# EAGLE design controladorCarga (EAGLE 7.2.0)
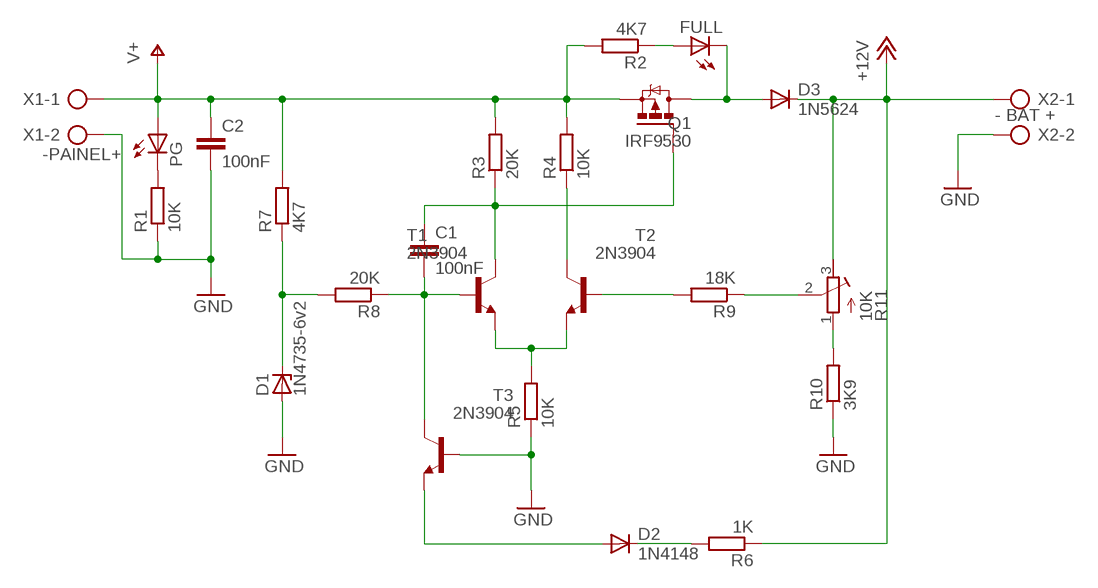
[diagram p0: schematic, sheet 1]

## Parts
C1  100nF  C-EU050-025X075  [C050-025X075]
C2  100nF  C-EU050-025X075  [C050-025X075]
D1  1N4735-6v2  1N4728  [DO41Z10]
D2  1N4148  1N4148DO35-7  [DO35-7]
D3  1N5624  [DO201-15]
FULL  LED5MM  [LED5MM]
PG  LED5MM  [LED5MM]
Q1  IRF9530  [TO220BV]
R1  10K  R-EU_0207/10  [0207/10]
R2  4K7  R-EU_0207/10  [0207/10]
R3  20K  R-EU_0207/10  [0207/10]
R4  10K  R-EU_0207/10  [0207/10]
R5  10K  R-EU_0207/10  [0207/10]
R6  1K  R-EU_0207/10  [0207/10]
R7  4K7  R-EU_0207/10  [0207/10]
R8  20K  R-EU_0204/7  [0204/7]
R9  18K  R-EU_0207/10  [0207/10]
R10  3K9  R-EU_0204/7  [0204/7]
R11  10K  R-TRIMM3339P  [RTRIM3339P]
T1  2N3904  [TO92]
T2  2N3904  [TO92]
T3  2N3904  [TO92]
X1  -PAINEL+  AK500/2  [AK500/2]
X2  - BAT +  AK500/2  [AK500/2]

## Nets
+12V: D3.C R6.1 R11.3(E) X2.1
GND: C2.2 D1.A R1.1 R5.1 R10.1 T3.2(B) X1.2 X2.2
N$1: PG.K(C) R1.2
N$2: FULL.A R2.1
N$3: C1.1 Q1.G R3.1 T1.1(C)
N$4: R4.1 T2.1(C)
N$5: D2.C R6.2
N$7: R5.2 T1.3(E) T2.3(E)
N$8: D3.A FULL.K(C) Q1.D
N$9: D1.C R7.1 R8.2
N$10: C1.2 R8.1 T1.2(B) T3.1(C)
N$12: D2.A T3.3(E)
N$13: R9.2 T2.2(B)
N$14: R9.1 R11.2(S)
N$15: R10.2 R11.1(A)
V+: C2.1 PG.A Q1.S R2.2 R3.2 R4.2 R7.2 X1.1

## Library data of the parts
C1 C2 = rcl:C-EU: CAPACITOR, European symbol
D1 = diode:1N4728: Z DIODE 3.3 V, 1W, 5 percent
D2 = diode:1N4148: DIODE high speed (Philips)
D3 = diode:1N5624: DIODE controlled avalanche rectifier
FULL PG = led:LED: LED OSRAM: - CHIPLED LG R971, LG N971, LY N971, LG Q971, LY Q971, LO R971, LY R971 LH N974, LH R974 LS Q976, LO Q976, LY Q976 LO Q996 - Hyper CHIPLED LW Q18S LB Q993, LB Q99A, LB R99A - SideLED LS A670, LO A670, LY A670, LG A670, LP A670 LB A673, LV A673, LT A673, LW A673 LH A674 LY A675 LS A676, LA A676, LO A676, LY A676, LW A676 LS A679, LY A679, LG A679 - Hyper Micro SIDELED® LS Y876, LA Y876, LO Y876, LY Y876 LT Y87S - SmartLED LW L88C, LW L88S LB L89C, LB L89S, LG L890 LS L89K, LO L89K, LY L89K LS L896, LA L896, LO L896, LY L896 - TOPLED LS T670, LO T670, LY T670, LG T670, LP T670 LSG T670, LSP T670, LSY T670, LOP T670, LYG T670 LG T671, LOG T671, LSG T671 LB T673, LV T673, LT T673, LW T673 LH T674 LS T676, LA T676, LO T676, LY T676, LB T676, LH T676, LSB T676, LW T676 LB T67C, LV T67C, LT T67C, LS T67K, LO T67K, LY T67K, LW E67C LS E67B, LA E67B, LO E67B, LY E67B, LB E67C, LV E67C, LT E67C LW T67C LS T679, LY T679, LG T679 LS T770, LO T770, LY T770, LG T770, LP T770 LB T773, LV T773, LT T773, LW T773 LH T774 LS E675, LA E675, LY E675, LS T675 LS T776, LA T776, LO T776, LY T776, LB T776 LHGB T686 LT T68C, LB T68C - Hyper Mini TOPLED® LB M676 - Mini TOPLED Santana® LG M470 LS M47K, LO M47K, LY M47K Source: http://www.osram.convergy.de LUXEON: - LUMILED® LXK2-PW12-R00, LXK2-PW12-S00, LXK2-PW14-U00, LXK2-PW14-V00 LXK2-PM12-R00, LXK2-PM12-S00, LXK2-PM14-U00 LXK2-PE12-Q00, LXK2-PE12-R00, LXK2-PE12-S00, LXK2-PE14-T00, LXK2-PE14-U00 LXK2-PB12-K00, LXK2-PB12-L00, LXK2-PB12-M00, LXK2-PB14-N00, LXK2-PB14-P00, LXK2-PB14-Q00 LXK2-PR12-L00, LXK2-PR12-M00, LXK2-PR14-Q00, LXK2-PR14-R00 LXK2-PD12-Q00, LXK2-PD12-R00, LXK2-PD12-S00 LXK2-PH12-R00, LXK2-PH12-S00 LXK2-PL12-P00, LXK2-PL12-Q00, LXK2-PL12-R00 Source: www.luxeon.com KINGBRIGHT: KA-3528ASYC Source: www.kingbright.com
Q1 = transistor-power:IRF9530: P-CHANNEL HEXFET POWER-MOS-FET Source: http://www.irf.com/product-info/datasheets/data/irf9530.pdf
R1-R10 = rcl:R-EU_: RESISTOR, European symbol
R11 = resistor:R-TRIMM: Trimm resistor
T1-T3 = transistor:2N3904: NPN TRANSISTOR
X1 X2 = con-ptr500:AK500/2: CONNECTOR; OC_FARNELL: unknown; OC_NEWARK: unknown

## Board
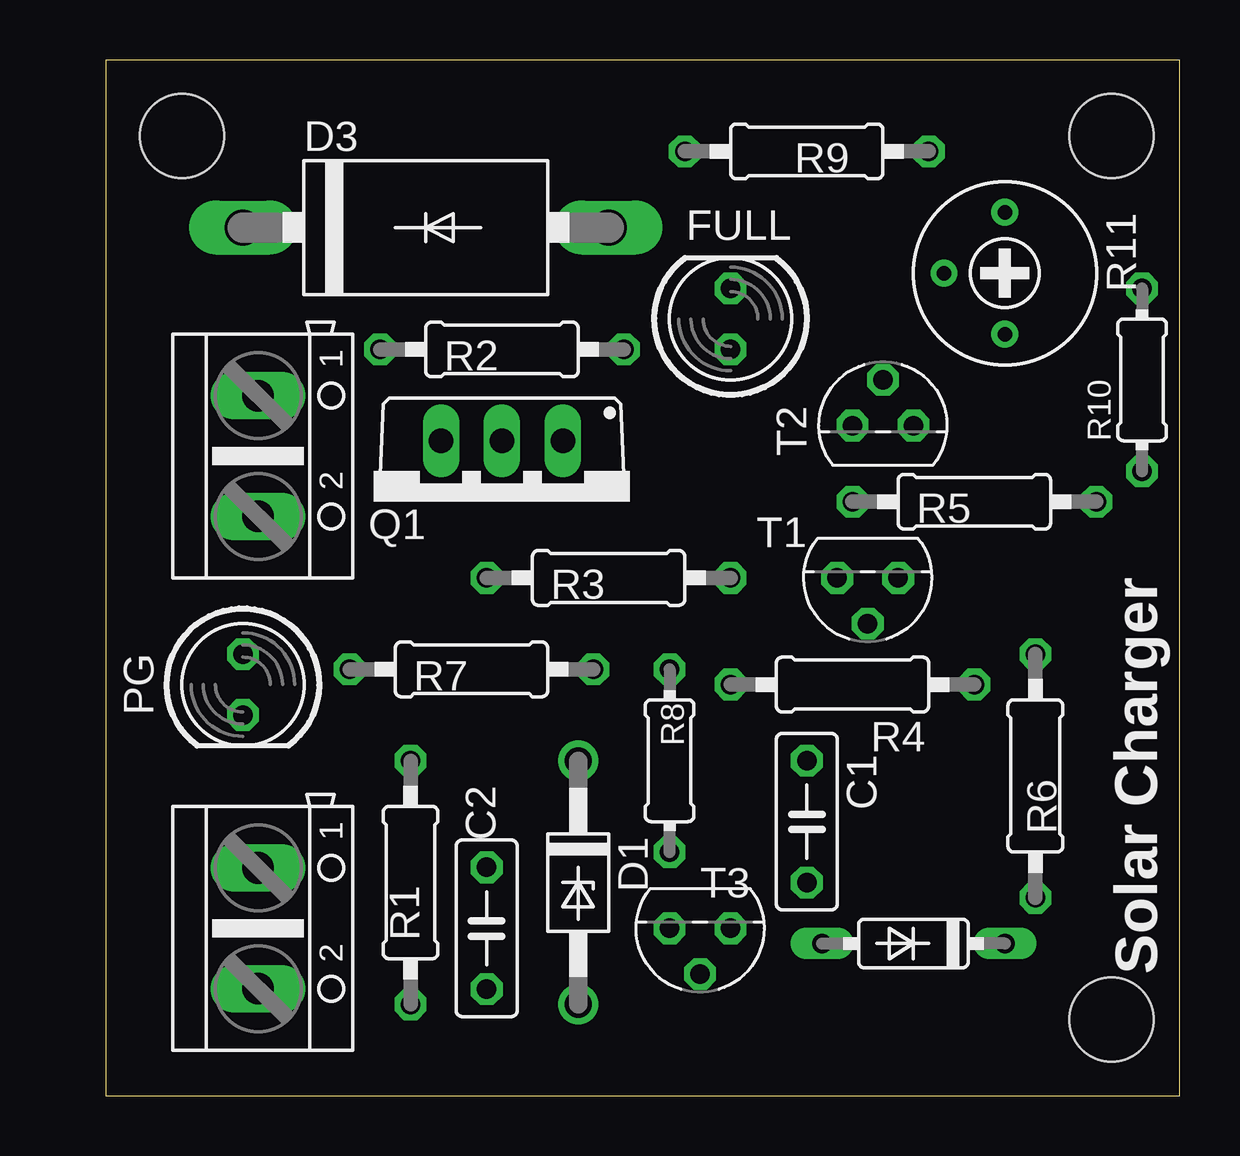
[diagram p1: board, top side]
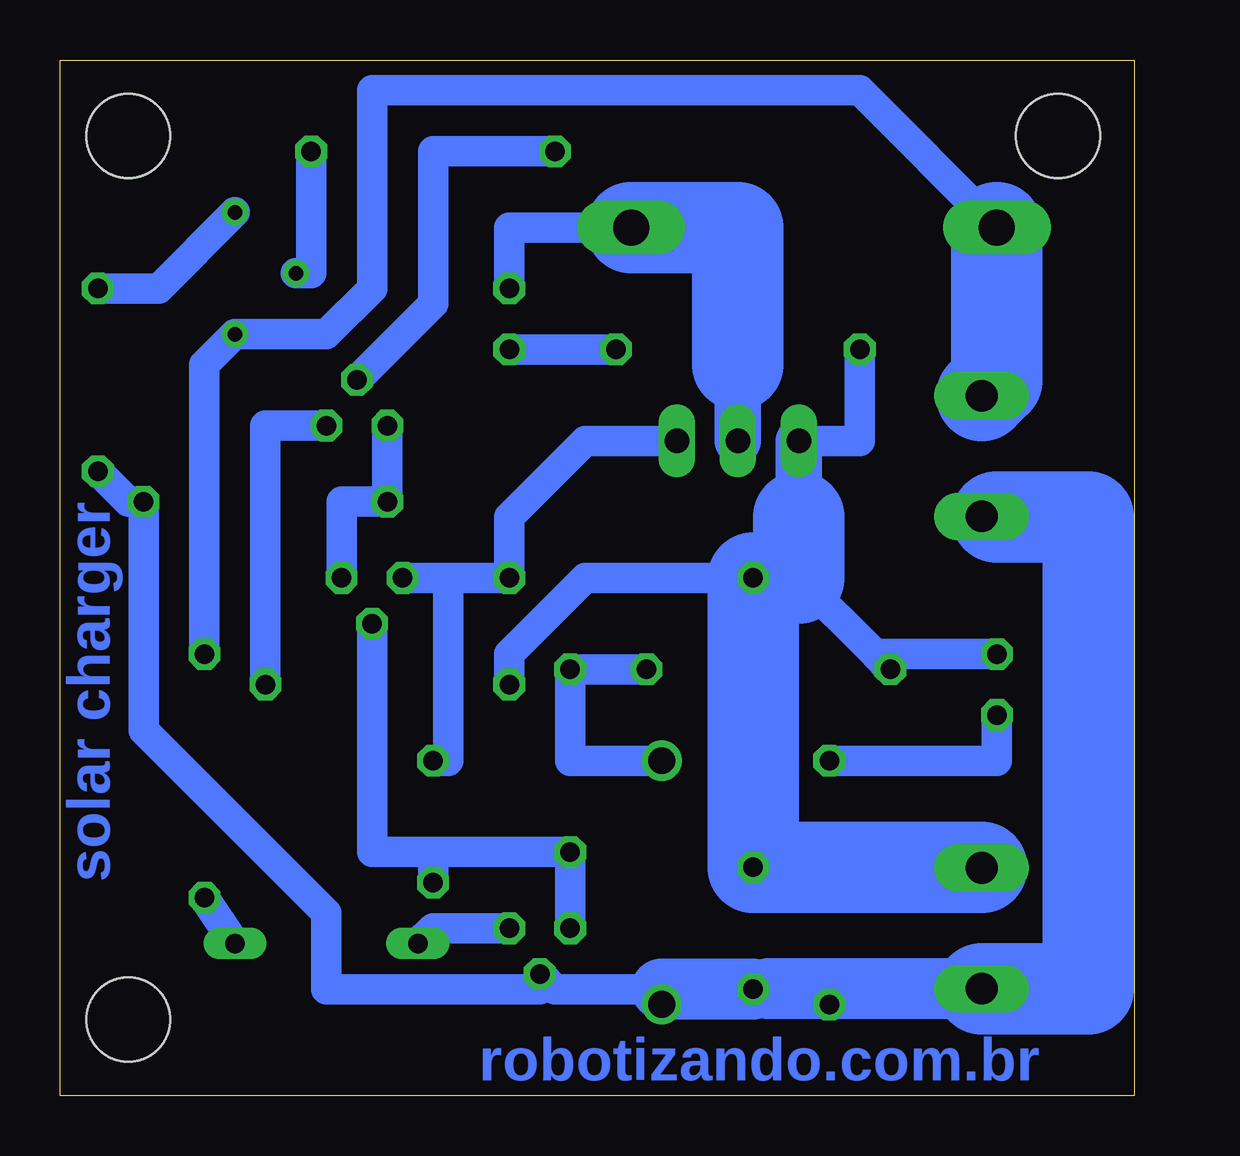
[diagram p2: board, bottom side, seen from below]

Size 44.75 x 43.17 mm. Coordinates in mm from the lower left corner, seen from the top.
Outline: 0,0 44.75,0 44.75,43.17 0,43.17 0,0
Copper layers (1*16): Top 0.035mm / dielectric 1.5mm / Bottom 0.035mm
Design rules "default": minimum track width 10mil, minimum drill 24mil, track to track 8mil, track to pad 8mil, pad to pad 8mil, via to via 8mil, smd to smd 8mil, copper to edge 40mil, drill to drill 8mil, minimum pad ring 10mil, minimum via ring 8mil, stop-mask expansion 4mil, vias tented up to drill 0mil, thermal gap 10mil
Holes 3.5 mm at 3.17,40.01 41.91,40.01 41.91,3.17

### Footprints (pad centres in the part's own frame; a part is rotated, then mirrored left to right if it is on the bottom)
C050-025X075 = drill 0.813 octagon: 1 -2.54,0; 2 2.54,0
DO41Z10 = drill 1.118: A 5.08,0; C -5.08,0
DO35-7 = drill 0.813 long: A 3.81,0; C -3.81,0
DO201-15 = drill 1.499 long: A 7.62,0; C -7.62,0
LED5MM = drill 0.813 octagon: A -1.27,0; K 1.27,0
TO220BV = drill 1.016 long: D 0,-2.54; G -2.54,-2.54; S 2.54,-2.54
0207/10 = drill 0.813 octagon: 1 -5.08,0; 2 5.08,0
0204/7 = drill 0.813 octagon: 1 -3.81,0; 2 3.81,0
RTRIM3339P = drill 0.61: 1 -2.54,0; 2 0,-2.54; 3 2.54,0
TO92 = drill 0.813 octagon: 1 1.27,0; 2 0,1.905; 3 -1.27,0
AK500/2 = drill 1.321 long: 1 -2.515,0; 2 2.515,0

### Placement (x,y rotation side)
C1  29.21,11.43 270 top
C2  15.88,6.99 270 top
D1  19.69,8.89 270 top
D2  33.66,6.35 180 top
D3  13.33,36.2 0 top
FULL  26.04,32.38 90 top
PG  5.71,17.14 270 top
Q1  16.51,24.77 180 top
R1  12.7,8.89 90 top
R2  16.51,31.11 180 top
R3  20.96,21.59 180 top
R4  31.12,17.14 180 top
R5  36.2,24.77 180 top
R6  38.73,13.34 270 top
R7  15.24,17.78 180 top
R8  23.5,13.97 90 top
R9  29.21,39.37 180 top
R10  43.18,29.84 90 top
R11  37.46,34.29 270 top
T1  31.75,21.59 180 top
T2  32.38,27.94 0 top
T3  24.77,6.99 180 top
X1  6.35,6.99 270 top
X2  6.35,26.67 270 top

### Tracks (layer width: path | path; a pad name or v marks a point on that pad's centre or on a via)
+12V
  Bottom 1.27: R6.1 38.73,30.48 R11.3 33.66,31.75 31.75,33.66 31.75,41.91 11.43,41.91 D3.C
  Bottom 3.81: X2.1 5.71,29.82 D3.C
GND
  Bottom 1.27: 15.24,4.47 C2.2 12.7,4.45 R1.1 | D1.A 19.69,4.45 24.13,4.45 T3.2 24.77,4.45 33.66,4.45 33.66,7.62 41.27,15.24 R5.1 41.91,24.77 R10.1 | 5.71,24.13 X2.2
  Bottom 2.54: X1.2 15.24,4.47 | C2.2 19.69,4.45
  Bottom 3.81: X1.2 1.91,4.47 1.91,24.13 5.71,24.13
N$1
  Bottom 1.27: R1.2 5.71,13.97 PG.K
N$2
  Bottom 1.27: FULL.A R2.1
N$3
  Bottom 1.27: Q1.G 22.86,27.3 26.04,24.13 R3.1 28.58,21.59 | C1.1 28.58,13.97 28.58,21.59 | T1.1 28.58,21.59
N$4
  Bottom 1.27: R4.1 36.2,27.94 T2.1
N$5
  Bottom 1.27: R6.2 D2.C
N$7
  Bottom 1.27: T1.3 33.02,24.77 R5.2 T2.3
N$8
  Bottom 1.27: FULL.K 26.04,36.2 D3.A
  Bottom 1.93: Q1.D 16.51,30.48
  Bottom 3.81: 16.51,30.48 16.51,36.2 D3.A
N$9
  Bottom 1.27: R7.1 R8.2 23.5,13.97 D1.C
N$10
  Bottom 1.27: T3.1 R8.1 29.21,10.16 | C1.2 29.21,10.16 | T1.2 31.75,10.16 29.21,10.16
N$12
  Bottom 1.27: T3.3 29.21,6.99 D2.A
N$13
  Bottom 1.27: T2.2 29.21,33.02 29.21,39.37 R9.2
N$14
  Bottom 1.27: R11.2 34.29,34.29 R9.1
N$15
  Bottom 1.27: R10.2 40.64,33.66 R11.1
V+
  Bottom 1.27: 6.35,9.53 X1.1 | PG.A 10.79,18.41 | 10.79,18.41 13.97,21.59 | 10.79,18.41 R7.2 | R2.2 11.43,27.3 Q1.S | R4.2 26.04,18.41 22.86,21.59 R3.2
  Bottom 1.93: Q1.S 13.97,24.13
  Bottom 2.54: 13.97,21.59 R3.2
  Bottom 3.81: 6.35,9.53 C2.1 R3.2 | 13.97,24.13 13.97,21.59

### Text on the board
Bottom: solar charger | robotizando.com.br
tPlace: Solar Charger